# EAGLE design Bread 2040 (EAGLE 9.5.2)
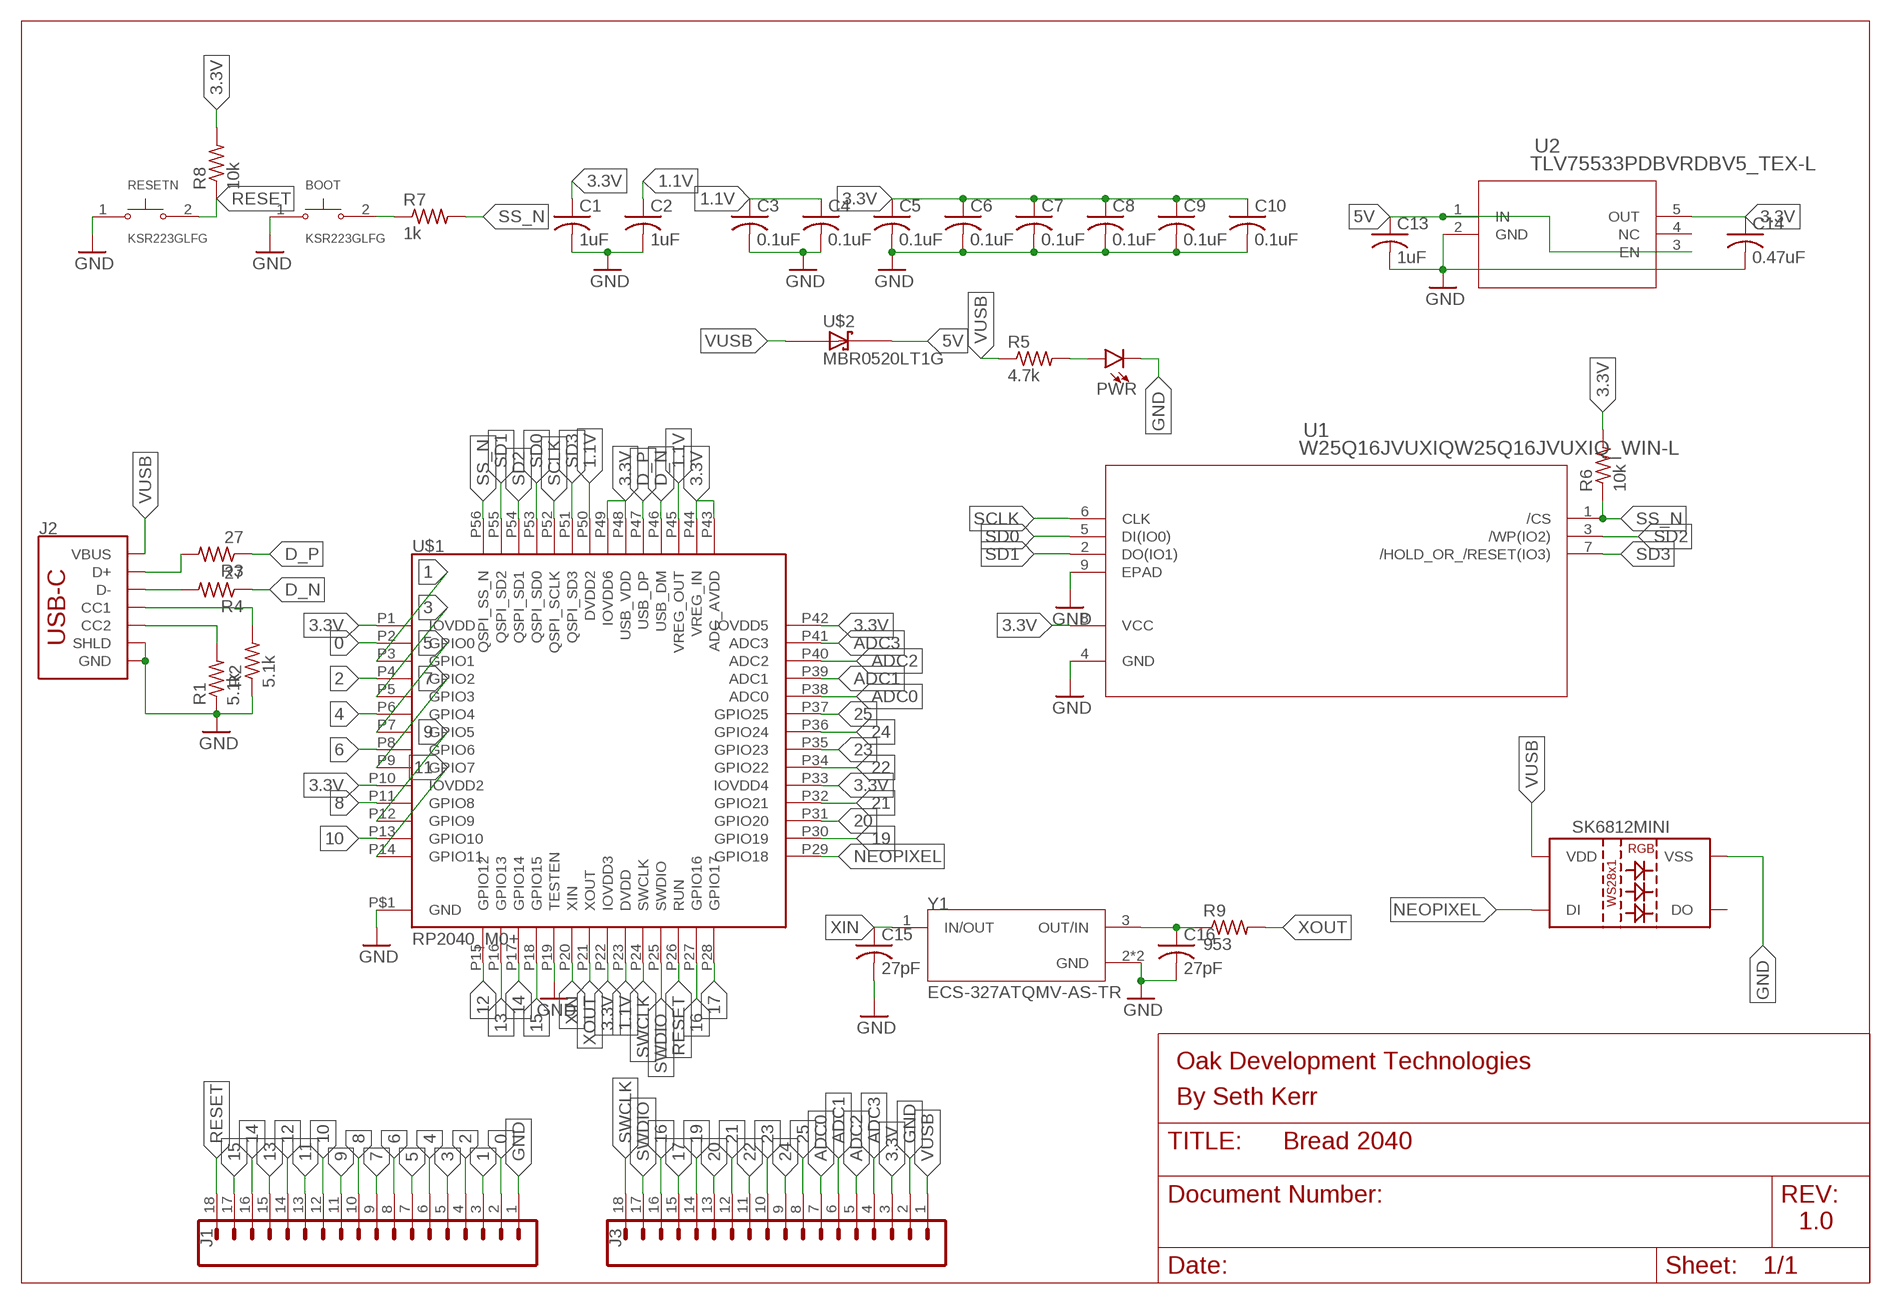
[diagram p0: schematic, sheet 1]

## Parts
BOOT  KSR223GLFG  [SW_KSR223GLFG]
C1  1uF  C-USC0603  [C0603]
C2  1uF  C-USC0603  [C0603]
C3  0.1uF  C-USC0603  [C0603]
C4  0.1uF  C-USC0603  [C0603]
C5  0.1uF  C-USC0603  [C0603]
C6  0.1uF  C-USC0603  [C0603]
C7  0.1uF  C-USC0603  [C0603]
C8  0.1uF  C-USC0603  [C0603]
C9  0.1uF  C-USC0603  [C0603]
C10  0.1uF  C-USC0603  [C0603]
C13  1uF  C-USC0603  [C0603]
C14  0.47uF  C-USC0603  [C0603]
C15  27pF  C-USC0402  [C0402]
C16  27pF  C-USC0402  [C0402]
J1  CONN_18  [1X18_NO_SILK]
J2  USB_C_2-LAYER_PADS  [USB-C-16P-2LAYER-PADS]
J3  CONN_18  [1X18_NO_SILK]
PWR  LED0603  [LED-0603]
R1  5.1k  R-US_R0603  [R0603]
R2  5.1k  R-US_R0603  [R0603]
R3  27  R-US_R0603  [R0603]
R4  27  R-US_R0603  [R0603]
R5  4.7k  R-US_R0603  [R0603]
R6  10k  R-US_R0603  [R0603]
R7  1k  R-US_R0603  [R0603]
R8  10k  R-US_R0603  [R0603]
R9  953  R-US_R0402  [R0402]
RESETN  KSR223GLFG  [SW_KSR223GLFG]
SK6812MINI  WS2812BWS2812B-3535  [WS2812-3535]
U1  W25Q16JVUXIQW25Q16JVUXIQ_WIN-L  [W25Q16JVUXIQ_WIN-L]
U2  TLV75533PDBVRDBV5_TEX-L  [DBV5_TEX-L]
U$1  RP2040_M0+  [QFN-56]
U$2  MBR0520LT1G  [SOD3716X117(SOD-123)]
Y1  ECS-327ATQMV-AS-TR  [XTAL_ECS-327ATQMV-AS-TR]

## Nets
0: J1.2 U$1.P2(GPIO0)
1: J1.3 U$1.P3(GPIO1)
1.1V: C2.1 C3.1 C4.1 U$1.P23(DVDD) U$1.P45(VREG_OUT) U$1.P50(DVDD2)
2: J1.4 U$1.P4(GPIO2)
3: J1.5 U$1.P5(GPIO3)
3.3V: C1.1 C5.1 C6.1 C7.1 C8.1 C9.1 C10.1 C14.1 J3.3 R6.2 R8.2 U1.8(VCC) U2.5(OUT) U$1.P1(IOVDD) U$1.P10(IOVDD2) U$1.P22(IOVDD3) U$1.P33(IOVDD4) U$1.P42(IOVDD5) U$1.P43(ADC_AVDD) U$1.P44(VREG_IN) U$1.P48(USB_VDD) U$1.P49(IOVDD6)
4: J1.6 U$1.P6(GPIO4)
5: J1.7 U$1.P7(GPIO5)
5V: C13.1 U2.1(IN) U2.3(EN) U$2.1(C)
6: J1.8 U$1.P8(GPIO6)
7: J1.9 U$1.P9(GPIO7)
8: J1.10 U$1.P11(GPIO8)
9: J1.11 U$1.P12(GPIO9)
10: J1.12 U$1.P13(GPIO10)
11: J1.13 U$1.P14(GPIO11)
12: J1.14 U$1.P15(GPIO12)
13: J1.15 U$1.P16(GPIO13)
14: J1.16 U$1.P17(GPIO14)
15: J1.17 U$1.P18(GPIO15)
16: J3.16 U$1.P27(GPIO16)
17: J3.15 U$1.P28(GPIO17)
19: J3.14 U$1.P30(GPIO19)
20: J3.13 U$1.P31(GPIO20)
21: J3.12 U$1.P32(GPIO21)
22: J3.11 U$1.P34(GPIO22)
23: J3.10 U$1.P35(GPIO23)
24: J3.9 U$1.P36(GPIO24)
25: J3.8 U$1.P37(GPIO25)
ADC0: J3.7 U$1.P38(ADC0)
ADC1: J3.6 U$1.P39(ADC1)
ADC2: J3.5 U$1.P40(ADC2)
ADC3: J3.4 U$1.P41(ADC3)
D_N: R4.1 U$1.P46(USB_DM)
D_P: R3.1 U$1.P47(USB_DP)
GND: BOOT.1 C1.2 C2.2 C3.2 C4.2 C5.2 C6.2 C7.2 C8.2 C9.2 C10.2 C13.2 C14.2 C15.2 C16.2 J1.1 J2.GND J2.GND2(GND) J2.P$1(SHLD) J2.P$2(SHLD) J2.P$3(SHLD) J2.P$4(SHLD) J2.SHLD1(SHLD) J2.SHLD2(SHLD) J2.SHLD3(SHLD) J2.SHLD4(SHLD) J3.2 PWR.C R1.1 R2.1 RESETN.1 SK6812MINI.VSS U1.4(GND) U1.9(EPAD) U2.2(GND) U$1.P19(TESTEN) U$1.P$1(GND) Y1.2(GND) Y1.4(GND)
N$1: PWR.A R5.2
N$3: J2.A5(CC1) R2.2
N$4: J2.B5(CC2) R1.2
N$8: C16.1 R9.1 Y1.3(OUT/IN)
N$69: BOOT.2 R7.1
NEOPIXEL: SK6812MINI.DIN(DI) U$1.P29(GPIO18)
RESET: J1.18 R8.1 RESETN.2 U$1.P26(RUN)
SCLK: U1.6(CLK) U$1.P52(QSPI_SCLK)
SD0: U1.5(DI(IO0)) U$1.P53(QSPI_SD0)
SD1: U1.2(DO(IO1)) U$1.P55(QSPI_SD2)
SD2: U1.3(/WP(IO2)) U$1.P54(QSPI_SD1)
SD3: U1.7(/HOLD_OR_/RESET(IO3)) U$1.P51(QSPI_SD3)
SS_N: R6.1 R7.2 U1.1(/CS) U$1.P56(QSPI_SS_N)
SWCLK: J3.18 U$1.P24(SWCLK)
SWDIO: J3.17 U$1.P25(SWDIO)
USB_N: J2.A7(D-) J2.B7(D-) R4.2
USB_P: J2.A6(D+) J2.B6(D+) R3.2
VUSB: J2.VBUS1(VBUS) J2.VBUS2(VBUS) J3.1 R5.1 SK6812MINI.VDD U$2.2(A)
XIN: C15.1 U$1.P20(XIN) Y1.1(IN/OUT)
XOUT: R9.2 U$1.P21(XOUT)
Unconnected: SK6812MINI.DOUT(DO) U2.4(NC)

## Notes on the sheet
- Oak Development Technologies
- By Seth Kerr
- 1.0

## Library data of the parts
BOOT RESETN = KSR223GLFG:KSR223GLFG: Switch Tactile N.O. SPST Round Button Gull Wing 0.01A 32VDC 0.2VA 200000Cycles 2N SMD Automotive T/R; AVAILABILITY: Unavailable; DESCRIPTION: Tactile Switch SPST-NO Top Actuated Surface Mount; MF: C&K; MP: KSR223GLFG; PACKAGE: None; PRICE: None
C1-C10 C13-C16 = rcl:C-US: CAPACITOR, American symbol; SPICEPREFIX: C
J1 J3 = SparkFun-Connectors:CONN_18: Multi connection point. Often used as Generic Header-pin footprint for 0.1 inch spaced/style header connections On any of the 0.1 inch spaced packages, you can populate with these: Break Away Headers - Straight <https://www.sparkfun.com/products/116> (PRT-00116) Break Away Male Headers - Right Angle <https://www.sparkfun.com/products/553> (PRT-00553) Female Headers <https://www.sparkfun.com/products/115> (PRT-00115) Break Away Headers - Machine Pin <https://www.sparkfun.com/products/117> (PRT-00117) Break Away Female Headers - Swiss Machine Pin <https://www.sparkfun.com/products/743> (PRT-00743) For SCREWTERMINALS and SPRING TERMINALS visit here: Screw Terimnals on SparkFun.com <https://www.sparkfun.com/search/results?term=Screw+Terminals> (5mm/3.5mm/2.54mm spacing) This device is also useful as a general connection point to wire up your design to another part of your project. Our various solder wires solder well into these plated through hole pads. Hook-Up Wire - Assortment (Stranded, 22 AWG) <https://www.sparkfun.com/products/11375> (PRT-11375) Hook-Up Wire - Assortment (Solid Core, 22 AWG) <https://www.sparkfun.com/products/11367> (PRT-11367) View the entire wire category on our website here <https://www.sparkfun.com/categories/141> Special notes: Molex polarized connector foot print use with SKU : PRT-08231 with associated crimp pins and housings. 1MM SMD Version SKU: PRT-10208 NOTES ON THE VARIANTS LOCK and LOCK_LONGPADS... This footprint was designed to help hold the alignment of a through-hole component (i.e. 6-pin header) while soldering it into place. You may notice that each hole has been shifted either up or down by 0.005 of an inch from it's more standard position (which is a perfectly straight line). This slight alteration caused the pins (the squares in the middle) to touch the edges of the holes. Because they are alternating, it causes a "brace" to hold the component in place. 0.005 has proven to be the perfect amount of "off-center" position when using our standard breakaway headers. Although looks a little odd when you look at the bare footprint, once you have a header in there, the alteration is very hard to notice. Also,if you push a header all the way into place, it is covered up entirely on the bottom side.
J2 = SparkFun-Connectors:USB_C: USB Type C 16Pin Connector Super Speed pins not available on the 16-pin purely SMD connector so this part is best for USB 2.0 implementations. D1 and D2 are tied together enabling D+/- no matter which way the cable is plugged into the connector. The two channel configuration pins (CC1/2) are exposed. These are normally connected to ground via 5.1k resistors but can be reconfigured for high current/high power applications.; PROD_ID: CONN-14122
PWR = SparkFun-LED:LED: LED (Generic) Standard schematic elements and footprints for 5mm, 3mm, 1206, and 0603 sized LEDs. Generic LEDs with no color specified.
R1-R9 = rcl:R-US_: RESISTOR, American symbol; SPICEPREFIX: R
SK6812MINI = SparkFun-LED:WS2812B: WS2812B SMD addressable RGB LED 5x5mm SMD LED with built-in controller IC. Color: Red/Green/Blue mC Rating: RGB: 390, 660, 180 mcd Forward Voltage: RGB: 2.0, 3.0, 3.0 V Packages:WS2812B SparkFun Products: Blynk Board - ESP8266 <https://www.sparkfun.com/products/13794>
U1 = Winbond SPI Flash:W25Q16JVUXIQ; BUILT_BY: EMA_Colton; COPYRIGHT: Copyright (C) 2018 Accelerated Designs. All rights reserved; DATASHEET: https://www.mouser.com/datasheet/2/949/w25n01gw_reve_021318_unsecured-1489855.pdf; MANUFACTURER_PART_NUMBER: W25Q16JVUXIQ; SOURCELIBRARY: Winbond_2020-03-18; VENDOR: Winbond
U2 = TLV75533pdbvr:TLV75533PDBVR; COPYRIGHT: Copyright (C) 2018 Accelerated Designs. All rights reserved; MANUFACTURER_PART_NUMBER: TLV75533PDBVR; SOURCELIBRARY: TI_2019-06-18; VENDOR: Texas Instruments
U$1 = RP2040_M0:RP2040_M0+
U$2 = MBR0520LT1G:MBR0520LT1G: Surface Mount Schottky Power Rectifier Plastic SOD−123 Package; AVAILABILITY: Unavailable; DESCRIPTION: Diode Schottky 20V 500mA Surface Mount SOD-123; MF: ON Semiconductor; MP: MBR0520LT1G; PACKAGE: SOD-123 ON Semiconductor; PRICE: None
Y1 = ECS-327ATQMV-AS-TR:ECS-327ATQMV-AS-TR: The ECX-33Q is a miniature SMD Crystal with a 3.2 x 2.5 mm footprint. AEC-Q200 Qualified.; ARROW_ELECTRONICS-PURCHASE-URL: https://snapeda.com/shop?store=Arrow+Electronics&id=3210300; DESCRIPTION: 32.768kHz XO (Standard) CMOS Oscillator 1.62V ~ 3.63V Enable/Disable 4-SMD, No Lead; DIGI-KEY_PART_NUMBER: XC2826CT-ND; MF: ECS Inc.; MOUSER-PURCHASE-URL: https://snapeda.com/shop?store=Mouser&id=3210300; MP: ECS-327ATQMV-AS-TR; PACKAGE: SMD-4 ECS Inc.

## Board
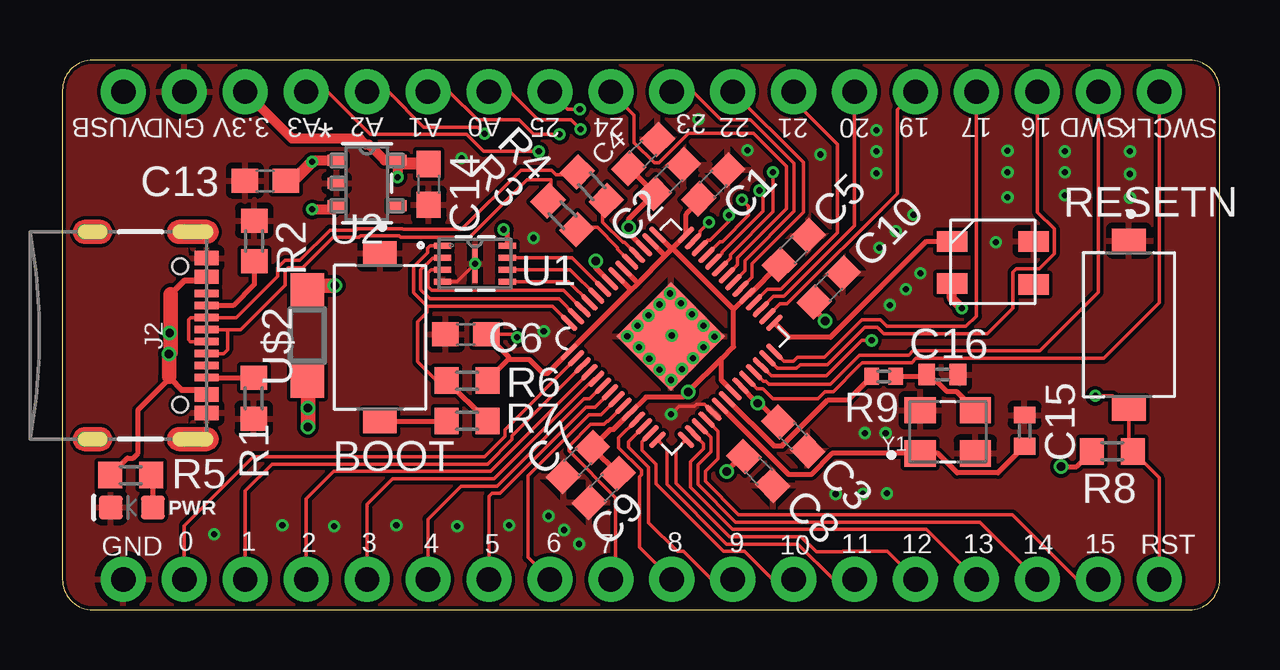
[diagram p1: board, top side]
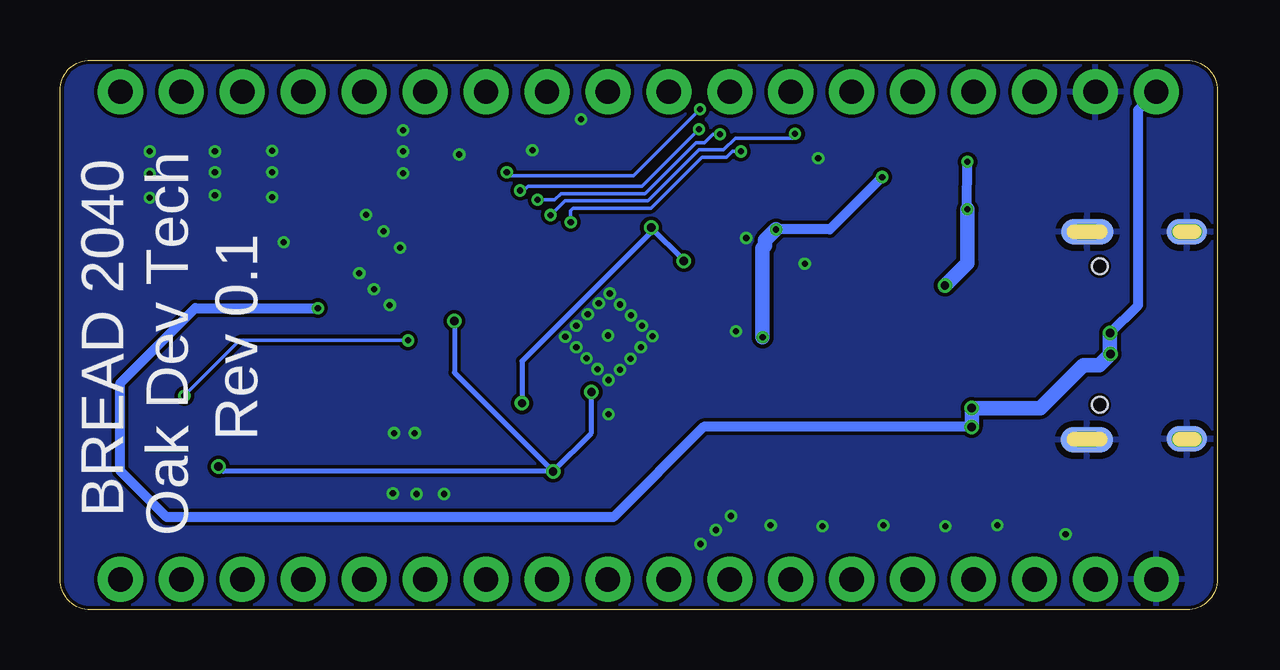
[diagram p2: board, bottom side, seen from below]

Size 48.24 x 22.91 mm. Coordinates in mm from the lower left corner, seen from the top.
Outline: 0,21.64 0,1.27 arc90 1.27,0 46.97,0 arc90 48.24,1.27 48.24,21.64 arc90 46.97,22.91 1.27,22.91 arc90 0,21.64
Copper layers (1*16): Top 0.035mm / dielectric 1.5mm / Bottom 0.035mm
Design rules "default *": minimum track width 6mil, minimum drill 10mil, track to track 6mil, track to pad 6mil, pad to pad 6mil, via to via 6mil, smd to smd 6mil, copper to edge 6mil, drill to drill 6mil, minimum pad ring 5mil, minimum via ring 5mil, stop-mask expansion 1mil, vias tented up to drill 15mil, thermal gap 10mil

### Footprints (pad centres in the part's own frame; a part is rotated, then mirrored left to right if it is on the bottom)
SW_KSR223GLFG = smd 1 x 1.4: 1 -3.5,0; 2 3.5,0
C0603 = smd 1.1 x 1: 1 -0.85,0; 2 0.85,0
C0402 = smd 0.7 x 0.9: 1 -0.65,0; 2 0.65,0
1X18_NO_SILK = drill 1.016 pad 1.88: 1 0,0; 2 2.54,0; 3 5.08,0; 4 7.62,0; 5 10.16,0; 6 12.7,0; 7 15.24,0; 8 17.78,0; 9 20.32,0; 10 22.86,0; 11 25.4,0; 12 27.94,0; 13 30.48,0; 14 33.02,0; 15 35.56,0; 16 38.1,0; 17 40.64,0; 18 43.18,0
USB-C-16P-2LAYER-PADS = smd 0.3 x 1: A5 -1.25,-0.34; A6 -0.25,-0.34; A7 0.25,-0.34; A8 1.25,-0.34; B5 1.75,-0.34; B6 0.75,-0.34; B7 -0.75,-0.34; B8 -1.75,-0.34 | smd 0.6 x 1: GND -3.225,-0.34; GND2 3.225,-0.34; VBUS1 -2.45,-0.34; VBUS2 2.45,-0.34 | smd 1.067 x 2.184 bottom: P$1 -4.318,-0.94; P$2 4.343,-0.914 | smd 1.067 x 1.676 bottom: P$3 -4.318,-5.08; P$4 4.293,-5.08 | drill 0.4 pad 0.6 long: SHLD1 -4.318,-0.915; SHLD2 4.318,-0.915; SHLD3 -4.318,-5.095; SHLD4 4.318,-5.095 | hole 0.65: -2.89,-1.445; 2.89,-1.445
LED-0603 = smd 1 x 1: A -0.877,0; C 0.877,0
R0603 = smd 1 x 1.1: 1 -0.85,0; 2 0.85,0
R0402 = smd 0.6 x 0.7: 1 -0.5,0; 2 0.5,0
WS2812-3535 = smd 1.27 x 0.85: DIN 0.05,2.6; DOUT 3.45,0.8; VDD 0.05,0.85; VSS 3.45,2.6
W25Q16JVUXIQ_WIN-L = smd 0.711 x 0.254: 1 -1.348,0.75; 2 -1.348,0.25; 3 -1.348,-0.25; 4 -1.348,-0.75; 5 1.348,-0.75; 6 1.348,-0.25; 7 1.348,0.25; 8 1.348,0.75 | smd 0.203 x 1.6: 9 0,0
DBV5_TEX-L = smd 0.775 x 0.457: 1 -1.264,0.95; 2 -1.264,0; 3 -1.264,-0.95; 4 1.264,-0.95; 5 1.264,0.95
QFN-56 = smd 0.875 x 0.2: P1 -3.5,2.55; P2 -3.5,2.15; P3 -3.5,1.75; P4 -3.5,1.35; P5 -3.5,0.95; P6 -3.5,0.55; P7 -3.5,0.15; P8 -3.5,-0.25; P9 -3.5,-0.65; P10 -3.5,-1.05; P11 -3.5,-1.45; P12 -3.5,-1.85; P13 -3.5,-2.25; P14 -3.5,-2.65; P29 3.4,-2.65; P30 3.4,-2.25; P31 3.4,-1.85; P32 3.4,-1.45; P33 3.4,-1.05; P34 3.4,-0.65; P35 3.4,-0.25; P36 3.4,0.15; P37 3.4,0.55; P38 3.4,0.95; P39 3.4,1.35; P40 3.4,1.75; P41 3.4,2.15; P42 3.4,2.55 | smd 0.2 x 0.875: P15 -2.65,-3.5; P16 -2.25,-3.5; P17 -1.85,-3.5; P18 -1.45,-3.5; P19 -1.05,-3.5; P20 -0.65,-3.5; P21 -0.25,-3.5; P22 0.15,-3.5; P23 0.55,-3.5; P24 0.95,-3.5; P25 1.35,-3.5; P26 1.75,-3.5; P27 2.15,-3.5; P28 2.55,-3.5; P43 2.55,3.4; P44 2.15,3.4; P45 1.75,3.4; P46 1.35,3.4; P47 0.95,3.4; P48 0.55,3.4; P49 0.15,3.4; P50 -0.25,3.4; P51 -0.65,3.4; P52 -1.05,3.4; P53 -1.45,3.4; P54 -1.85,3.4; P55 -2.25,3.4; P56 -2.65,3.4 | smd 3.2 x 3.2: P$1 -0.05,0
SOD3716X117(SOD-123) = smd 1.4 x 1.4: 1 -1.9,0.051; 2 1.9,0.051
XTAL_ECS-327ATQMV-AS-TR = smd 1.3 x 1.1: 1 -1.15,-0.9; 2 1.15,-0.9; 3 1.15,0.9; 4 -1.15,0.9

### Placement (x,y rotation side)
BOOT  13.23,11.35 270 top
C1  27.13,17.73 45 top
C2  25.28,17.95 45 top
C3  30.46,7.23 315 top
C4  24.2,19 45 top
C5  30.49,14.99 45 top
C6  16.81,11.48 180 top
C7  21.48,6.16 225 top
C8  29.01,5.79 315 top
C9  22.56,5.08 225 top
C10  31.94,13.43 45 top
C13  8.46,17.88 180 top
C14  15.27,17.73 270 top
C15  40.11,7.47 90 top
C16  36.68,9.8 0 top
J1  2.54,1.27 0 top
J2  6.35,11.43 270 top
J3  2.54,21.59 0 top
PWR  2.9,4.27 180 top
R1  7.98,8.81 90 top
R2  8,15.37 270 top
R3  20.84,16.44 135 top
R4  22.06,17.65 135 top
R5  2.84,5.61 0 top
R6  16.87,9.55 0 top
R7  16.87,7.87 0 top
R8  43.76,6.6 180 top
R9  34.24,9.73 180 top
RESETN  44.45,11.89 270 top
SK6812MINI  37.03,12.75 0 top
U1  17.2,14.43 0 top
U2  12.7,17.78 0 top
U$1  25.4,11.43 45 top
U$2  10.16,11.43 270 top
Y1  36.91,7.42 0 top

### Tracks (layer width: path | path; a pad name or v marks a point on that pad's centre or on a via)
0
  Top 0.152: U$1.P2 18.44,7.51 18.44,7.23 17.59,6.38 7.95,6.38 5.08,3.5 J1.2
1
  Top 0.152: J1.3 7.62,4.95 8.74,6.07 17.72,6.07 18.75,7.1 18.75,7.25 U$1.P3
1.1V  (via drill 0.35)
  Top 0.203: U$1.P50 22.23,14.24 v22.23,14.54 | U$1.P45 23.6,15.7 v23.6,15.93 23.6,16.28 C2.1 23.63,18.4 C4.1 | U$1.P23 28.26,9.33 v28.98,8.61 29.08,8.61 C3.1
  Bottom 0.203: v22.23,14.54 22.23,14.56 v23.6,15.93 23.6,15.74 28.98,10.36 v28.98,8.61
2
  Top 0.152: U$1.P4 19.05,6.99 19.05,6.98 17.84,5.77 11.3,5.77 10.16,4.62 J1.4
3
  Top 0.152: J1.5 12.7,4.39 13.77,5.46 17.99,5.46 22.15,9.63 U$1.P5
3.3V  (via drill 0.25, 0.35)
  Top 0.152: C6.1 18.82,11.48 v18.95,11.35
  Top 0.203: v18.39,15.85 18.54,15.7 U1.8 | R6.2 18.61,10.44 | 18.61,10.44 19.46,10.44 20.04,9.86 20.22,9.86 U$1.P1 23.62,13.26 | C6.1 18.61,10.54 18.61,10.44 | U$1.P49 23.62,13.42 23.62,13.26 | 23.62,13.26 24,13.64 | 24,13.64 25.09,14.73 | U$1.P44 25.09,14.78 25.09,14.73 | 25.09,14.73 25.44,15.07 | 25.44,15.07 U$1.P42 26,16.48 26.44,16.92 26.44,17.04 C1.1 | U$1.P43 25.36,15.07 25.44,15.07 | U$1.P48 23.97,13.64 24,13.64 | 27.98,12.53 U$1.P33 28.59,13.09 C5.1 | 27.98,12.53 27.98,10.95 27.47,10.44 | U$1.P22 27.47,9.57 27.47,10.44 | 27.47,10.44 27.47,10.47 v26.09,9.08 25.87,8.87 24.32,8.87 U$1.P10 22.97,7.52 22.84,7.52 C7.1 C9.1 | 27.98,12.53 25.44,15.07 | C8.1 28.31,6.39 v27.69,5.77 | C10.1 31.34,12.5 v31.8,12.04 | v41.63,5.97 42.28,5.97 R8.2
  Top 0.406: v13.97,18.03 13.97,18.59 U2.5 13.43,18.73 12.78,19.38 12.65,19.38 12.39,19.63 9.58,19.63 J3.3
  Top 0.508: C14.1 13.98,18.58 13.97,18.59
  Bottom 0.203: v27.69,5.77 26.09,7.37 v26.09,9.08 | v31.8,12.04 31.8,9.88 v27.69,5.77 | v27.69,5.77 41.43,5.77 v41.63,5.97
  Bottom 0.406: v13.97,18.03 16.15,15.85 v18.39,15.85
  Bottom 0.61: v18.39,15.85 18.85,15.39 18.85,15.17 18.95,15.07 v18.95,11.35
4
  Top 0.152: U$1.P6 21.98,8.79 21.75,8.79 18.11,5.16 16.61,5.16 15.24,3.79 J1.6
5
  Top 0.152: J1.7 17.78,4.72 17.91,4.85 18.24,4.85 21.82,8.43 22.19,8.43 U$1.P7
5V  (via drill 0.25, 0.35)
  Top 0.406: v10.41,16.69 11.29,16.69 U2.3 | v10.41,18.67 10.53,18.73 U2.1
  Top 0.508: v10.41,18.67 9.63,17.88 C13.1
  Top 0.61: U$2.1 10.39,13.51 v11.35,13.51
  Bottom 0.406: v10.41,16.69 10.44,16.71 v10.41,18.67
  Bottom 0.61: v11.35,13.51 10.41,14.45 v10.41,16.69
6
  Top 0.152: U$1.P8 22.45,8.13 21.95,8.13 19.41,5.59 19.41,2.18 J1.8
7
  Top 0.152: U$1.P9 22.74,7.85 22.7,7.85 22.59,7.73 22.02,7.73 21.11,6.82 21.11,6.63 23.06,4.67 23.06,1.47 J1.9
8
  Top 0.152: U$1.P11 23.19,7.17 23.19,6.75 24.13,5.81 24.13,5.62 24.05,5.54 24.05,2.62 J1.10
9
  Top 0.152: U$1.P12 23.59,7.01 23.59,6.78 24.43,5.94 24.43,3.63 25.63,2.44 25.88,2.44 27.05,1.27 J1.11
10
  Top 0.152: U$1.P13 24.16,7 24.16,6.64 24.74,6.06 24.74,5.26 27.56,2.44 28.42,2.44 29.59,1.27 J1.12
11
  Top 0.152: U$1.P14 25.2,6.68 25.2,5.23 27.68,2.74 30.66,2.74 32.13,1.27 J1.13
12
  Top 0.152: U$1.P15 25.6,6.68 25.58,6.68 25.58,5.28 27.81,3.05 30.79,3.05 31.42,2.41 32.51,2.41 32.54,2.44 34.39,2.44 J1.14
13
  Top 0.152: U$1.P16 26.72,6.93 26.72,6.71 26.19,6.17 26.19,5.1 27.94,3.35 36.02,3.35 J1.15
14
  Top 0.152: U$1.P17 27.03,7.19 27.03,6.58 26.49,6.05 26.49,5.23 28.06,3.66 38.25,3.66 J1.16
15
  Top 0.152: U$1.P18 27.33,7.45 27.33,6.3 26.8,5.77 26.8,5.36 28.19,3.96 39.6,3.96 42.29,1.27 J1.17
16
  Top 0.152: J3.16 40.64,16.58 41.35,15.87 41.35,14.83 40.72,14.2 39.75,14.2 39.62,14.07 39.62,12.57 38.56,11.51 34.24,11.51 33.96,11.79 33.45,11.79 31.88,10.21 30.76,10.21 30.61,10.06 29.81,10.06 U$1.P27
17
  Top 0.152: U$1.P28 30.07,10.37 30.48,10.37 30.63,10.52 31.75,10.52 33.33,12.09 34.09,12.09 34.37,11.81 37.67,11.81 38.1,12.24 J3.15
19
  Top 0.152: U$1.P30 29.9,12.75 30.2,12.75 34.8,17.34 34.8,20.83 J3.14
20
  Top 0.152: J3.13 33.02,16 30.08,13.06 29.65,13.06 U$1.P31
21
  Top 0.152: U$1.P32 29.39,13.36 29.95,13.36 32.31,15.72 32.31,19.41 30.48,21.23 J3.12
22
  Top 0.152: U$1.P34 28.75,13.86 28.75,14.43 30.89,16.56 30.89,18.64 J3.11
23
  Top 0.152: U$1.P35 28.45,14.12 28.45,14.55 30.49,16.6 30.49,18.61 28.68,20.42 27.46,20.42 26.29,21.59 J3.10
24
  Top 0.152: U$1.P36 28.14,14.38 28.14,14.68 30.18,16.71 30.18,18.49 28.8,19.86 26.1,19.86 24.86,18.63 24.68,18.63 23.83,19.47 23.83,20.62 J3.9
25  (via drill 0.25)
  Top 0.152: J3.8 21.06,20.85 v21.57,20.85 | v29.62,18.24 29.62,16.58 27.84,14.81 27.84,14.65 U$1.P37
  Bottom 0.152: v21.57,20.85 24.33,18.09 29.46,18.09 v29.62,18.24
ADC0  (via drill 0.25)
  Top 0.152: U$1.P38 27.16,14.51 27.49,14.84 27.49,14.89 29.21,16.61 29.21,17.32 v29.06,17.48 | J3.7 18.67,21.59 19.84,20.42 21.21,20.42 v21.6,20.03
  Bottom 0.152: v29.06,17.48 28.91,17.48 28.73,17.65 23.98,17.65 v21.6,20.03
ADC1  (via drill 0.25)
  Top 0.152: v20.73,19.81 19.63,19.81 19.02,20.42 17.3,20.42 16.13,21.59 J3.6 | U$1.P39 27.4,15.34 27.51,15.34 28.6,16.43 28.6,16.82 v28.33,17.09
  Bottom 0.152: v28.33,17.09 27.62,17.09 27.36,17.35 23.85,17.35 21.73,19.47 21.37,19.47 21.02,19.81 v20.73,19.81
ADC2  (via drill 0.25)
  Top 0.152: U$1.P40 26.9,15.4 27,15.4 27.79,16.19 v27.79,16.45 | v17.6,19.84 17.32,20.12 15.06,20.12 13.59,21.59 J3.5
  Bottom 0.152: v27.79,16.45 27.2,17.04 23.73,17.04 21.61,19.16 20.59,19.16 20.09,19.66 17.7,19.66 17.6,19.76 v17.6,19.84
ADC3  (via drill 0.25)
  Top 0.152: U$1.P41 26.28,15.38 26.57,15.66 26.57,15.77 v26.95,16.15 | v19.86,19.1 17.55,19.1 16.84,19.81 12.83,19.81 11.05,21.59 J3.4
  Bottom 0.152: v26.95,16.15 26.95,16.64 26.85,16.74 23.6,16.74 21.48,18.86 20.46,18.86 20.22,19.1 v19.86,19.1
D_N
  Top 0.152: U$1.P46 23.43,15.31 23.36,15.31 22.52,16.15 22.52,16.91 R4.1
D_P
  Top 0.152: U$1.P47 23.14,15.03 23.14,15.1 22.31,15.93 21.53,15.93 R3.1
GND  (via drill 0.25)
  Top 0.152: U1.4 16.45,13.68 U1.9 | U$1.P19 27.12,8.21 26.77,8.56 26.42,8.56 26.34,8.47 25.7,8.47 v25.38,8.15 | v25.4,11.43 U$1.P$1
  other vias: 20.07,11.61 21.54,2.74 20.9,3.33 20.27,3.91 32.23,4.83 33.38,4.83 34.37,4.85 33.45,7.37 34.32,7.37 34.06,15.09 34.75,15.77 35.48,16.46 38.91,15.32 35.76,14.02 35.15,13.36 34.49,12.7 44.5,17.17 44.5,18.16 44.5,19.1 41.78,19.1 41.78,18.24 41.78,17.27 33.93,19.99 33.93,19.1 33.93,18.19 28.55,19.15 26.52,20.45 19.63,15.49 16.64,18.82 18.62,3.53 16.46,3.48 13.92,3.53 11.33,3.48 9.17,3.53 6.32,3.15 31.6,18.97 39.4,17.2 39.4,18.24 39.4,19.13 17.2,14.43 26.24,12.32 26.72,11.84 27.18,11.38 26.72,10.95 26.29,10.49 25.83,10.03 25.37,9.58 24.89,10.01 24.46,10.46 24.03,10.95 23.55,11.4 23.98,11.84 24.43,12.27 24.89,12.73 25.32,13.18 25.78,12.78
  pour Top: -3.81,26.67 50.8,26.67 50.8,-2.54 -3.81,-2.54
  pour Bottom: -2.54,25.4 49.53,25.4 49.53,-1.27 -1.27,-1.27 -2.54,-1.27
N$1
  Top 0.203: R5.2 3.77,5.54 PWR.A
N$3
  Top 0.203: R2.2 8,13.56 7.12,12.68 J2.A5
N$4
  Top 0.203: J2.B5 7.96,9.68 R1.2
N$8
  Top 0.203: R9.1 35.95,9.73 C16.1 36.17,9.8 36.87,9.1 37.27,9.1 Y1.3
N$69
  Top 0.203: BOOT.2 15.99,7.85 R7.1
NEOPIXEL
  Top 0.203: SK6812MINI.DIN 36.02,15.35 32.02,11.35 30.29,11.35 U$1.P29
RESET  (via drill 0.25)
  Top 0.152: RESETN.2 44.45,8.26 | 44.45,8.26 44.45,6.77 R8.1 45.72,5.5 J1.18 | U$1.P26 29.55,9.76 31.85,9.76 33.33,11.23 v33.73,11.23 | v43.05,8.91 43.79,8.91 44.45,8.26
  Bottom 0.152: v33.73,11.23 40.74,11.23 v43.05,8.91
SCLK
  Top 0.152: U1.6 21.17,14.18 U$1.P52
SD0
  Top 0.152: U$1.P53 21.09,13.68 U1.5
SD1
  Top 0.152: U1.2 15.83,14.66 15.42,14.66 14.94,14.17 14.94,13.34 15.32,12.95 20.69,12.95 U$1.P55
SD2
  Top 0.152: U$1.P54 20.89,13.32 15.4,13.32 15.33,13.39 15.32,13.39 15.24,13.46 15.24,14.05 15.37,14.18 U1.3
SD3
  Top 0.152: U1.7 21.23,14.68 U$1.P51
SS_N
  Top 0.152: U$1.P56 20.43,12.65 15.19,12.65 | 15.19,12.65 14.63,13.21 14.63,14.3 15.21,14.88 15.21,15.06 15.33,15.18 U1.1 | 15.19,12.65 15.19,12.4 14.81,12.01 14.81,10.34 15.6,9.55 R6.1
  Top 0.203: R7.2 17.69,7.87 R6.1
SWCLK
  Top 0.152: U$1.P24 28.96,9.22 29.21,9.22 29.62,8.8 31.5,8.8 31.78,9.08 32.13,9.08 33.21,10.16 33.21,10.17 33.34,10.31 35.41,10.31 35.58,10.48 43.4,10.48 45.72,12.8 J3.18
SWDIO
  Top 0.152: U$1.P25 29.22,9.52 29.33,9.52 29.45,9.4 32.02,9.4 32.91,10.29 32.91,10.3 33.22,10.61 35.28,10.61 35.46,10.79 40.73,10.79 43.18,13.23 J3.17
USB_N
  Top 0.152: J2.A7 5.33,11.18 5.26,11.25 5.26,12.09 5.35,12.18 J2.B7 7.23,12.18 7.24,12.17 8.98,13.9 8.98,14.25 9.29,14.56 9.89,14.56 11.15,15.82 12.25,15.82 12.31,15.89 14.15,15.89 14.19,15.85 16.64,15.85 19.11,18.33 20.38,18.33 20.47,18.24 | 20.47,18.24 | 20.47,18.24 20.59,18.12 21.33,18.12 R4.2
USB_P
  Top 0.152: J2.A6 6.84,11.68 | 6.84,11.68 6.88,11.63 6.88,10.85 6.72,10.68 J2.B6 | 6.84,11.68 7.44,11.68 9.28,13.52 9.28,14.12 9.42,14.26 10.02,14.26 11.28,15.52 12.38,15.52 12.44,15.58 14.03,15.58 14.09,15.52 15.38,15.52 15.4,15.53 16.98,15.53 19.37,17.92 20.36,17.92 20.37,17.91 20.37,17.17 R3.2
VUSB  (via drill 0.25, 0.35)
  Top 0.203: R5.1 2.71,6.33 2.95,6.33 3.15,6.53 3.15,8.33 4.48,9.66
  Top 0.254: J2.VBUS1 5.84,13.71 5.07,13.71 4.52,13.16 | 4.45,9.7 4.48,9.66 4.99,9.16 5.83,9.16 J2.VBUS2
  Top 0.406: v37.49,12.57 37.08,12.98 SK6812MINI.VDD
  Top 0.61: 4.52,13.16 4.52,10.74 v4.45,10.67 4.45,9.7 | v10.24,7.62 10.24,9.51 U$2.2
  Bottom 0.406: v4.47,11.53 3.3,12.7 3.3,20.83 J3.1 | v10.24,7.62 21.41,7.62 25.17,3.86 43.79,3.86 45.72,5.79 45.72,9.45 42.6,12.57 v37.49,12.57
  Bottom 0.61: v10.24,7.62 v10.24,8.41 7.37,8.41 5.59,10.19 4.93,10.19 v4.45,10.67 4.47,10.69 v4.47,11.53
XIN
  Top 0.203: C15.1 39,5.71 37.3,5.71 36.5,6.52 Y1.1 32.09,6.52 31.2,5.63 30.28,5.63 U$1.P20
XOUT
  Top 0.203: R9.2 32.76,8.75 31.92,8.75 30,6.83 29.65,6.83 U$1.P21

### Text on the board
tNames: A2 | A0 | 23 | VUSB | GND | 3.3V | A3 | A1 | 25 | 24 | 22 | 21 | 20 | 19 | 17 | 16 | SWD | SWCLK | GND | 0 | 1 | 2 | 3 | 4 | 5 | 6 | 7 | 8 | 9 | 10 | 11 | 12 | 13 | 14 | 15 | RST
bNames: Oak Dev Tech | BREAD 2040 | Rev 0.1